# EAGLE design controller-schematic (EAGLE 9.6.2)
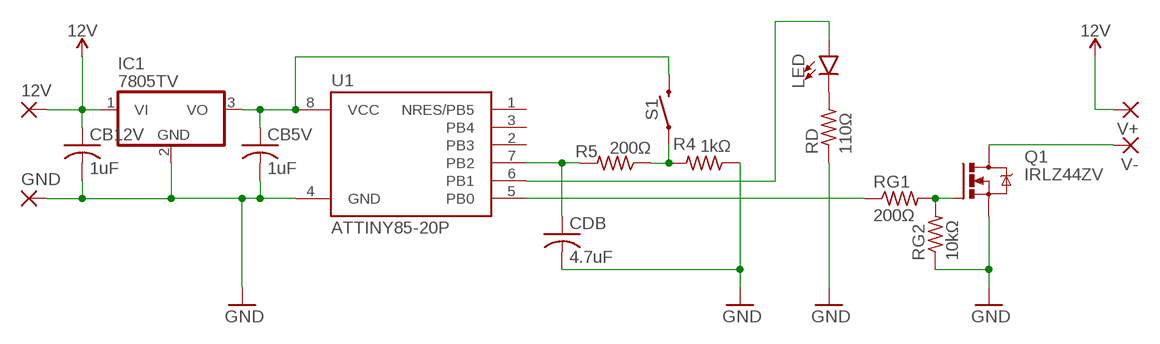
[diagram p0: schematic, sheet 1]

## Parts
12V  SMD5  [SMD2,54-5,08]
CB5V  1uF  C-US050-030X075  [C050-030X075]
CB12V  1uF  C-US050-030X075  [C050-030X075]
CDB  4.7uF  C-US050-030X075  [C050-030X075]
GND  SMD5  [SMD2,54-5,08]
IC1  7805TV  [TO220V]
LED  LED3MM  [LED_3MM]
Q1  IRLZ44ZV  [TO220BV]
R4  1kΩ  R-US_0207/7  [0207/7]
R5  200Ω  R-US_0207/7  [0207/7]
RD  110Ω  R-US_0207/7  [0207/7]
RG1  200Ω  R-US_0207/7  [0207/7]
RG2  10kΩ  R-US_0207/7  [0207/7]
S1  MOMENTARY-SWITCH-SPST-PTH-6.0MM  [TACTILE_SWITCH_PTH_6.0MM]
U1  ATTINY85-20P  [PDIP08_300MIL]
V+  SMD5  [SMD2,54-5,08]
V-  SMD5  [SMD2,54-5,08]

## Nets
5V: CB5V.1 IC1.3(VO) S1.3 U1.8(VCC)
12V: 12V.1(P) CB12V.1 IC1.1(VI) V+.1(P)
GND: CB5V.2 CB12V.2 CDB.2 GND.1(P) IC1.2(GND) Q1.S R4.1 RD.1 RG2.1 U1.4(GND)
N$2: RG1.1 U1.5(PB0)
N$3: Q1.G RG1.2 RG2.2
N$4: Q1.D V-.1(P)
N$5: LED.K(C) RD.2
N$6: LED.A U1.6(PB1)
N$7: R4.2 R5.1 S1.1
N$8: CDB.1 R5.2 U1.7(PB2)
Unconnected: U1.1(NRES/PB5) U1.2(PB3) U1.3(PB4)

## Library data of the parts
12V GND V+ V- = wirepad_modified:SMD5: SMD PAD
CB5V CB12V CDB = rcl:C-US: CAPACITOR, American symbol; SPICEPREFIX: C
IC1 = linear:78*: Positive VOLTAGE REGULATOR Source: http://cache.national.com/ds/LM/LM78L05.pdf http://www.fairchildsemi.com/ds/LM/LM7805.pdf
LED = SparkFun-LED:LED: LED (Generic) Standard schematic elements and footprints for 5mm, 3mm, 1206, and 0603 sized LEDs. Generic LEDs with no color specified.; PROD_ID: DIO-08794
Q1 = transistor-power:IRLZ44Z: N-Channel HEXFET® Power MOSFET Logic Level AUTOMOTIVE MOSFET Source: http://www.irf.com/product-info/datasheets/data/irlz44zpbf.pdf
R4 R5 RD RG1 RG2 = rcl:R-US_: RESISTOR, American symbol; SPICEPREFIX: R
S1 = SparkFun-Switches:MOMENTARY-SWITCH-SPST: Momentary Switch (Pushbutton) - SPST Normally-open (NO) SPST momentary switches (buttons, pushbuttons). Variants PTH-12MM - 12mm square, through-hole Momentary Pushbutton Switch - 12mm Square <https://www.sparkfun.com/products/9190> (COM-09190) PTH-6.0MM, PTH-6.0MM-KIT - 6.0mm square, through-hole Mini Pushbutton Switch <https://www.sparkfun.com/products/97> (COM-00097) KIT package intended for soldering kit's - only one side of pads' copper is exposed. PTH-RIGHT-ANGLE-KIT - Right-angle, through-hole Right Angle Tactile Button <https://www.sparkfun.com/products/10791> - Used on SparkFun BigTime Watch Kit <https://www.sparkfun.com/products/11734> SMD-12MM - 12mm square, surface-mount Tactile Button - SMD (12mm) <https://www.sparkfun.com/products/12993> (COM-12993) Used on SparkFun PicoBoard <https://www.sparkfun.com/products/11888> SMD-4.5MM - 4.5mm Square Trackball Switch Used on SparkFun Blackberry Trackballer Breakout <https://www.sparkfun.com/products/13169> SMD-4.6MMX2.8MM - 4.60mm x 2.80mm, surface mount Used on SparkFun Pro Micro - RP2040 <https://www.sparkfun.com/products/17717> SMD-5.2MM, SMD-5.2-REDUNDANT - 5.2mm square, surface-mount Mini Pushbutton Switch - SMD <https://www.sparkfun.com/products/8720> (COM-08720) Used on Arduino Pro Mini <https://www.sparkfun.com/products/11114> REDUNDANT package connects both switch circuits together SMD-6.0X3.5MM - 6.0 x 3.5mm, surface mount Momentary Reset Switch SMD <https://www.sparkfun.com/products/8229> (COM-08229) SMD-6.2MM-TALL - 6.2mm square, surface mount Tactile Button - SMD (6mm) <https://www.sparkfun.com/products/12992> Used on SparkFun Digital Sandbox <https://www.sparkfun.com/products/12651> SMD-RIGHT-ANGLE - Right-angle, surface mount Used on SparkFun Block for Intel® Edison - Arduino <https://www.sparkfun.com/products/13036>; PROD_ID: SWCH-08441; SF_SKU: COM-00097
U1 = _hhn_attiny25_45_85:ATTINY85*: ATMEL ATtiny 85 Packages: P = PDIP 08 30mil S = SOIC 08 EIAJ 208mil Technologies Note: for complete ordering code (temp. range, finish, tape&reel etc.) see www.atmel.com • Supply Voltage: V = (1.8…5.5)V | [blank] = (2.7…5.5)V • Speed: 10 = 10 MHz | 20 = 20 MHz Author: Dipl.-Ing. FH Rainer Bayer HHN Hochschule Heilbronn (Heilbronn University), rainer.bayer@hs-heilbronn.de Ingenieurbüro ing-rb, mail@ing-rb.de

## Board
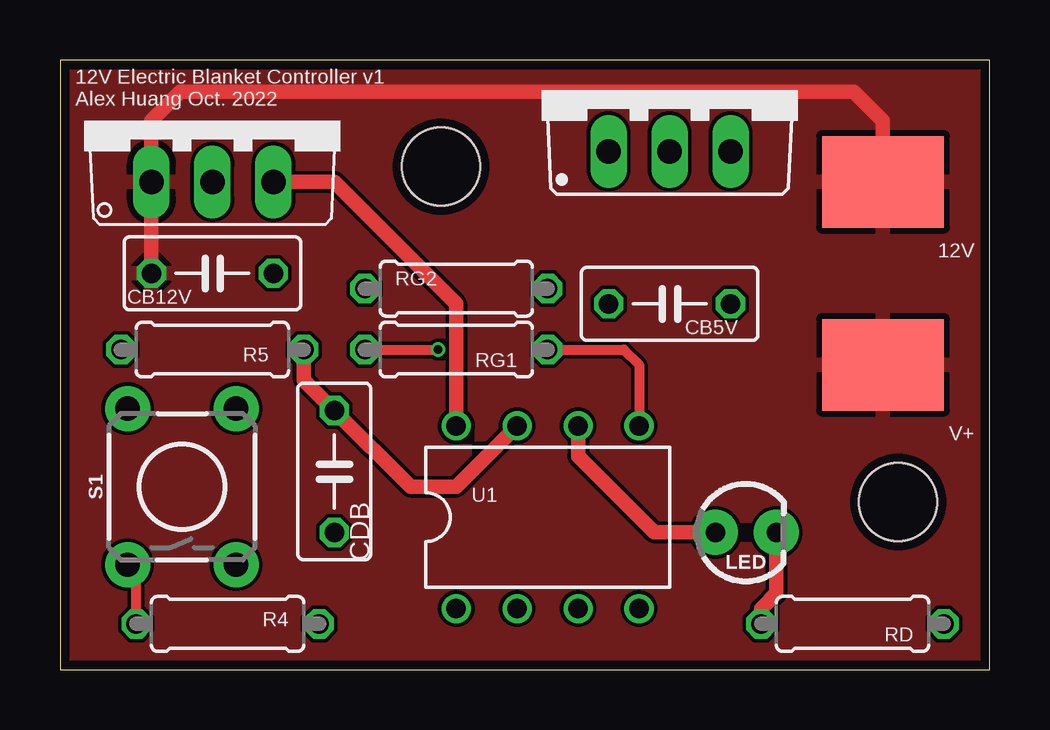
[diagram p1: board, top side]
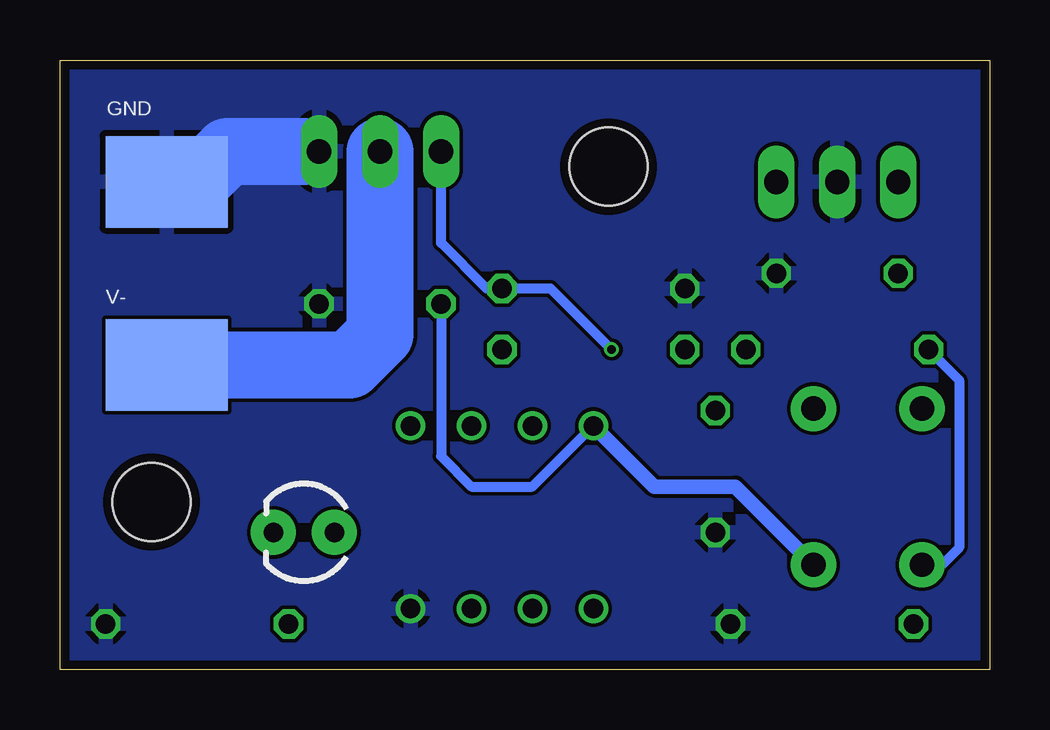
[diagram p2: board, bottom side, seen from below]

Size 38.73 x 25.4 mm. Coordinates in mm from the lower left corner, seen from the top.
Outline: 0,0 38.73,0 38.73,25.4 0,25.39 0,0
Copper layers (1*16): Top 0.035559375mm / dielectric 1.6mm / Bottom 0.035559375mm
Design rules "oshpark-2layer": minimum track width 6mil, minimum drill 10mil, track to track 6mil, track to pad 6mil, pad to pad 6mil, via to via 6mil, smd to smd 6mil, copper to edge 15mil, drill to drill 6mil, minimum pad ring 5mil, minimum via ring 5mil, stop-mask expansion 2.5mil, vias tented up to drill 0mil, thermal gap 10mil
Holes 3.25 mm at 15.88,20.95 34.92,6.99

### Footprints (pad centres in the part's own frame; a part is rotated, then mirrored left to right if it is on the bottom)
SMD2,54-5,08 = smd 3.81 x 5.08: 1 0,0
C050-030X075 = drill 0.813 octagon: 1 -2.54,0; 2 2.54,0
TO220V = drill 1.016 long: 1 -2.54,-2.54; 2 0,-2.54; 3 2.54,-2.54
LED_3MM = drill 0.813 pad 1.88: A -1.27,0; K 1.27,0
TO220BV = drill 1.016 long: D 0,-2.54; G -2.54,-2.54; S 2.54,-2.54
0207/7 = drill 0.813 octagon: 1 -3.81,0; 2 3.81,0
TACTILE_SWITCH_PTH_6.0MM = drill 1.016 pad 1.88: 1 -3.251,2.261; 2 3.251,2.261; 3 -3.251,-2.261; 4 3.251,-2.261
PDIP08_300MIL = drill 0.813: 1 -3.81,-3.81; 2 -1.27,-3.81; 3 1.27,-3.81; 4 3.81,-3.81; 5 3.81,3.81; 6 1.27,3.81; 7 -1.27,3.81; 8 -3.81,3.81

### Placement (x,y rotation side)
12V  34.29,20.32 90 top
CB5V  25.4,15.24 0 top
CB12V  6.35,16.51 0 top
CDB  11.43,8.26 270 top
GND  34.29,20.32 270 bottom
IC1  6.35,22.86 0 top
LED  28.57,5.71 0 top
Q1  25.4,24.13 0 top
R4  6.99,1.91 180 top
R5  6.35,13.34 0 top
RD  33.02,1.91 180 top
RG1  16.51,13.34 180 top
RG2  16.51,15.88 0 top
S1  5.08,7.62 90 top
U1  20.32,6.35 0 top
V+  34.29,12.7 90 top
V-  34.29,12.7 90 bottom

### Tracks (layer width: path | path; a pad name or v marks a point on that pad's centre or on a via)
5V
  Top 0.61: IC1.3 11.43,20.32 16.51,15.24 U1.8
  Bottom 0.406: CB5V.1 22.86,8.89 21.59,7.62 19.05,7.62 U1.8
  Bottom 0.61: U1.8 13.97,7.62 10.59,7.62 S1.3
12V
  Top 0.61: CB12V.1 IC1.1 3.81,22.86 5.02,24.07 33.08,24.07 34.29,22.86 12V.1
  pour Top: -1.27,-1.27 -1.27,26.67 39.37,26.67 39.37,-1.27
GND
  Bottom 2.794: GND.1 33.02,20.32 31.75,21.59 28.57,21.59
  pour Bottom: 0,0 0,25.4 38.73,25.4 38.73,0
N$2
  Top 0.406: RG1.1 23.5,13.34 24.13,12.7 U1.5
N$3  (via drill 0.35)
  Top 0.406: RG1.2 v15.75,13.34
  Bottom 0.406: v15.75,13.34 18.29,15.88 RG2.2 20.95,15.88 22.86,17.78 Q1.G
N$4
  Bottom 2.794: V-.1 26.67,12.7 25.4,13.97 Q1.D
N$5
  Top 0.61: LED.K 29.84,3.17 29.21,2.54 RD.2
N$6
  Top 0.61: LED.A 24.77,5.71 21.59,8.89 U1.6
N$7
  Top 0.406: R4.2 3.17,4.01 S1.1
  Bottom 0.406: R5.1 1.27,12.06 1.27,5.08 1.98,4.37 S1.1
N$8
  Top 0.61: U1.7 16.51,7.62 14.61,7.62 CDB.1 10.16,12.06 R5.2

### Text on the board
tPlace: 12V Electric Blanket Controller v1 / Alex Huang Oct. 2022